# EAGLE design ESP_LED_CUBE (EAGLE 8.4.0)
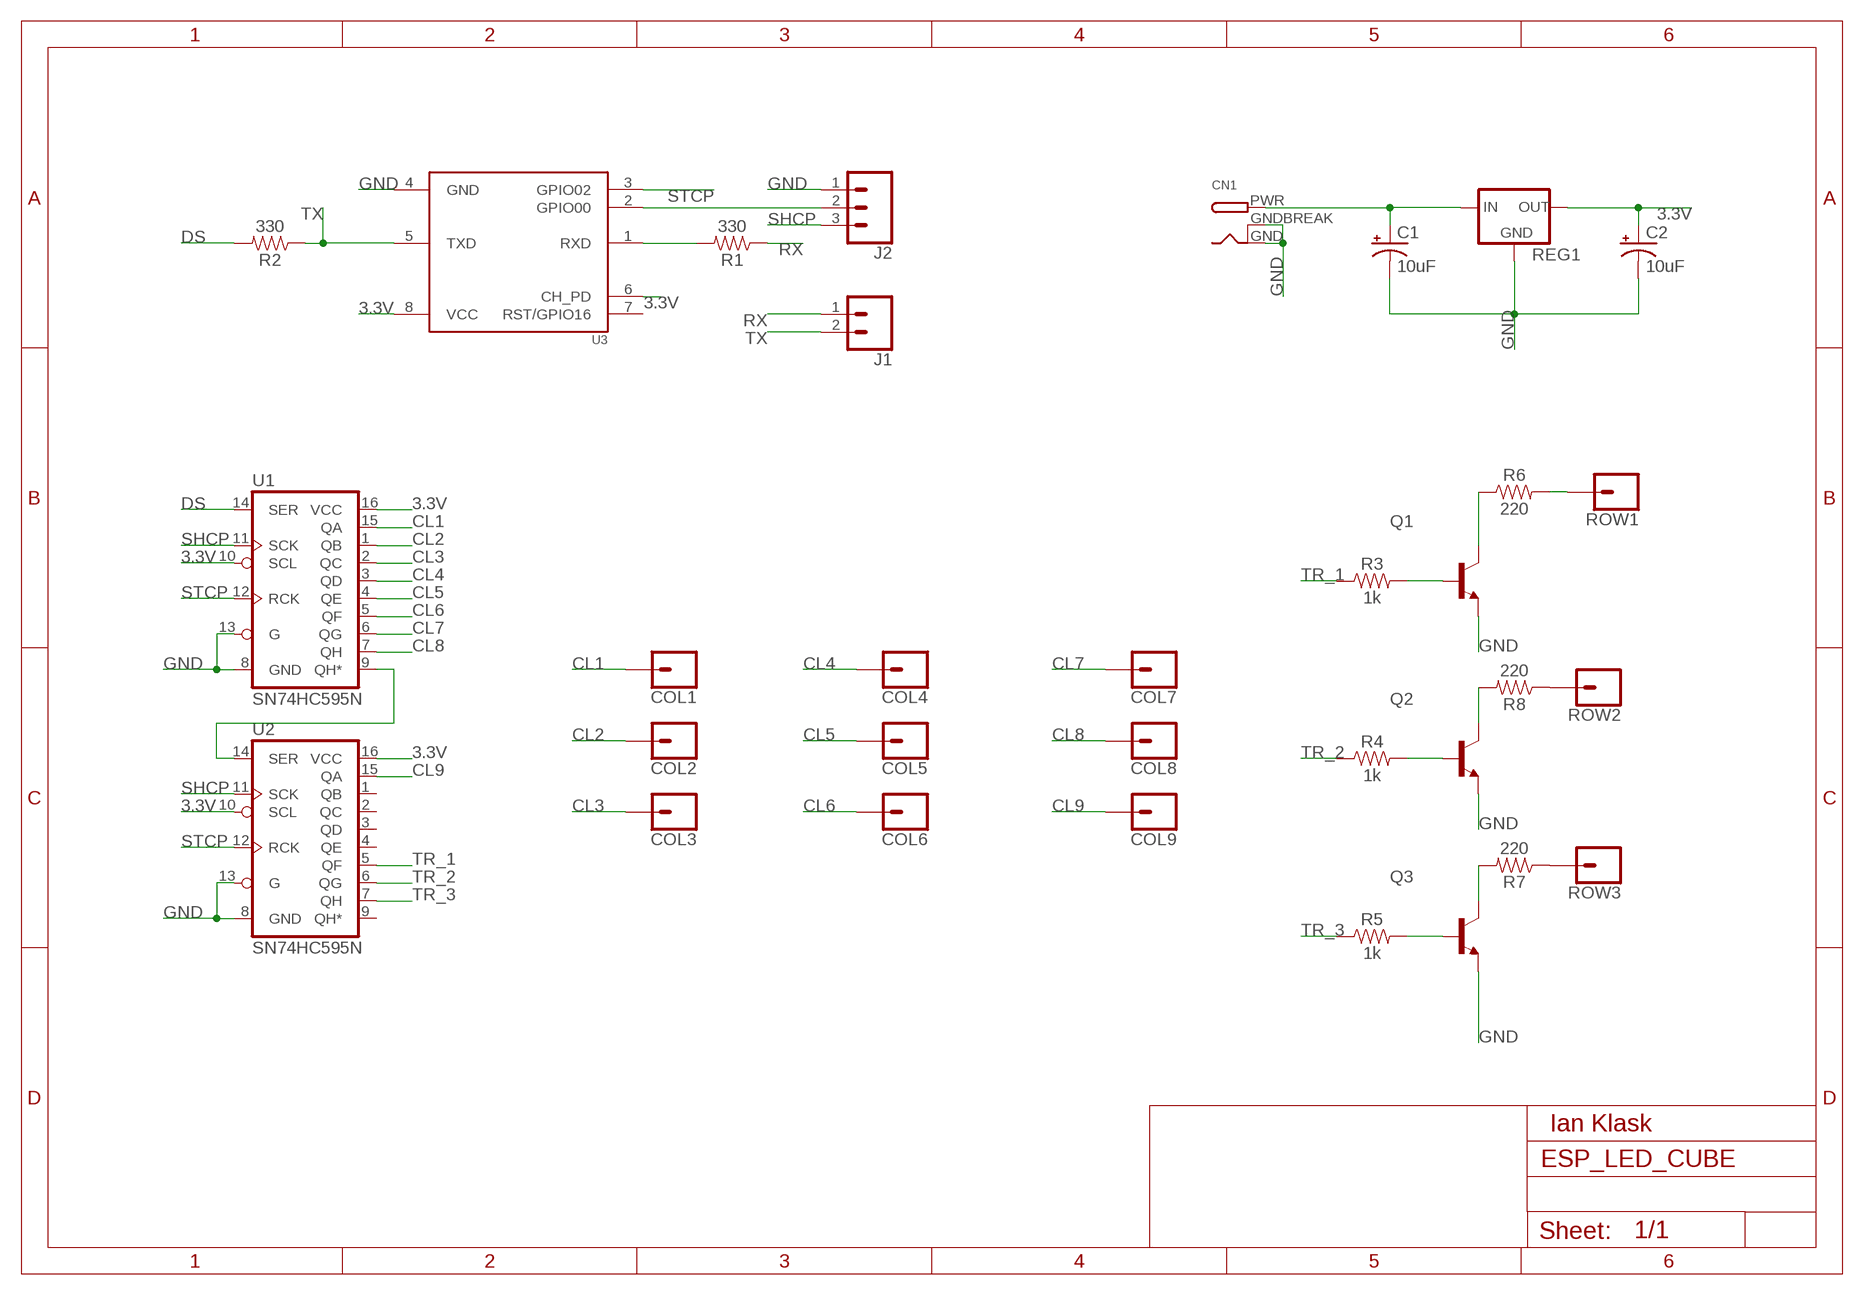
[diagram p0: schematic, sheet 1]

## Parts
C1  10uF  10UF-POLAR-RADIAL-2.5MM-25V-20%  [CPOL-RADIAL-2.5MM-5MM]
C2  10uF  10UF-POLAR-RADIAL-2.5MM-25V-20%  [CPOL-RADIAL-2.5MM-5MM]
CN1  DCBARRELPTH  [DCJACK_2MM_PTH]
COL1  CONN_01  [1X01]
COL2  CONN_01  [1X01]
COL3  CONN_01  [1X01]
COL4  CONN_01  [1X01]
COL5  CONN_01  [1X01]
COL6  CONN_01  [1X01]
COL7  CONN_01  [1X01]
COL8  CONN_01  [1X01]
COL9  CONN_01  [1X01]
J1  CONN_02  [1X02]
J2  CONN_03  [1X03]
Q1  2N3904  [TO92]
Q2  2N3904  [TO92]
Q3  2N3904  [TO92]
R1  330  330OHM-HORIZ-1/10W-5%  [AXIAL-0.3]
R2  330  330OHM-HORIZ-1/10W-5%  [AXIAL-0.3]
R3  1k  1KOHM-HORIZ-1/4W-1%  [AXIAL-0.3]
R4  1k  1KOHM-HORIZ-1/4W-1%  [AXIAL-0.3]
R5  1k  1KOHM-HORIZ-1/4W-1%  [AXIAL-0.3]
R6  220  330OHM-HORIZ-1/10W-5%  [AXIAL-0.3]
R7  220  330OHM-HORIZ-1/10W-5%  [AXIAL-0.3]
R8  220  330OHM-HORIZ-1/10W-5%  [AXIAL-0.3]
REG1  V_REG_LD1117VXX  [78XXL]
ROW1  CONN_01  [1X01]
ROW2  CONN_01  [1X01]
ROW3  CONN_01  [1X01]
U1  SN74HC595N  74HC595N  [DIP16]
U2  SN74HC595N  74HC595N  [DIP16]
U3  ESP8266-01/ESP-01  [XCVR_ESP8266-01/ESP-01]

## Nets
3.3V: C2.1(+) REG1.GND(OUT) U1.10(SCL) U1.16(VCC) U2.10(SCL) U2.16(VCC) U3.6(CH_PD) U3.8(VCC)
CL1: COL1.1 U1.15(QA)
CL2: COL2.1 U1.1(QB)
CL3: COL3.1 U1.2(QC)
CL4: COL4.1 U1.3(QD)
CL5: COL5.1 U1.4(QE)
CL6: COL6.1 U1.5(QF)
CL7: COL7.1 U1.6(QG)
CL8: COL8.1 U1.7(QH)
CL9: COL9.1 U2.15(QA)
DS: R2.P$2 U1.14(SER)
GND: C1.2(-) C2.2(-) CN1.GND CN1.GNDBREAK J2.1 Q1.3(E) Q2.3(E) Q3.3(E) REG1.IN(GND) U1.8(GND) U1.13(G) U2.8(GND) U2.13(G) U3.4(GND)
N$1: C1.1(+) CN1.PWR REG1.OUT(IN)
N$2: U1.9(QH*) U2.14(SER)
N$3: R1.P$2 U3.1(RXD)
N$4: Q1.1(C) R6.P$1
N$5: R7.P$1 ROW3.1
N$6: R8.P$1 ROW2.1
N$7: R6.P$2 ROW1.1
N$8: Q3.1(C) R7.P$2
N$9: Q2.1(C) R8.P$2
N$10: Q3.2(B) R5.P$2
N$11: Q2.2(B) R4.P$2
N$12: Q1.2(B) R3.P$2
N$16: J2.2 U3.2(GPIO00)
RX: J1.1 R1.P$1
SHCP: J2.3 U1.11(SCK) U2.11(SCK)
STCP: U1.12(RCK) U2.12(RCK) U3.3(GPIO02)
TR_1: R3.P$1 U2.5(QF)
TR_2: R4.P$1 U2.6(QG)
TR_3: R5.P$1 U2.7(QH)
TX: J1.2 R2.P$1 U3.5(TXD)
Unconnected: U2.1(QB) U2.2(QC) U2.3(QD) U2.4(QE) U2.9(QH*) U3.7(RST/GPIO16)

## Notes on the sheet
- Ian Klask

## Library data of the parts
C1 C2 = SparkFun-Capacitors:10UF-POLAR: 10.0µF polarized capacitors A capacitor is a passive two-terminal electrical component used to store electrical energy temporarily in an electric field.; PROD_ID: CAP-08440
CN1 = adafruit:DCBARREL: 2.0mm DC Barrel Jack DCJACK_2MM_PTH - Through Hole Jack (4UConnector: 05537)
COL1-COL9 ROW1-ROW3 = SparkFun-Connectors:CONN_01: Single connection point. Often used as Generic Header-pin footprint for 0.1 inch spaced/style header connections On any of the 0.1 inch spaced packages, you can populate with these: Break Away Headers - Straight <https://www.sparkfun.com/products/116> (PRT-00116) Break Away Male Headers - Right Angle <https://www.sparkfun.com/products/553> (PRT-00553) Female Headers <https://www.sparkfun.com/products/115> (PRT-00115) Break Away Headers - Machine Pin <https://www.sparkfun.com/products/117> (PRT-00117) Break Away Female Headers - Swiss Machine Pin <https://www.sparkfun.com/products/743> (PRT-00743) This device is also useful as a general connection point to wire up your design to another part of your project. Our various solder wires solder well into these plated through hole pads. Hook-Up Wire - Assortment (Stranded, 22 AWG) <https://www.sparkfun.com/products/11375> (PRT-11375) Hook-Up Wire - Assortment (Solid Core, 22 AWG) <https://www.sparkfun.com/products/11367> (PRT-11367) View the entire wire category on our website here <https://www.sparkfun.com/categories/141> Special notes: SMTSO-256-ET is a "flush mount" nut for a 4-40 screw. We mostly use this on specialty testbeds; it is a nice way to connect hardware to your PCB at an adjustable hieght. Also note, the SNAP packages are for using a snappable style connector. We sell a baggie of snaps and they are also used on two LilyPad designs: Snap Assortment - 30 pack (male and female) <https://www.sparkfun.com/products/11347> (DEV-11347) LilyPad Arduino SimpleSnap <https://www.sparkfun.com/products/10941> (DEV-10941) LilyPad SimpleSnap Protoboard <https://www.sparkfun.com/products/10940> (DEV-10940)
J1 = SparkFun-Connectors:CONN_02: Multi connection point. Often used as Generic Header-pin footprint for 0.1 inch spaced/style header connections On any of the 0.1 inch spaced packages, you can populate with these: Break Away Headers - Straight <https://www.sparkfun.com/products/116> (PRT-00116) Break Away Male Headers - Right Angle <https://www.sparkfun.com/products/553> (PRT-00553) Female Headers <https://www.sparkfun.com/products/115> (PRT-00115) Break Away Headers - Machine Pin <https://www.sparkfun.com/products/117> (PRT-00117) Break Away Female Headers - Swiss Machine Pin <https://www.sparkfun.com/products/743> (PRT-00743) For SCREWTERMINALS and SPRING TERMINALS visit here: Screw Terimnals on SparkFun.com <https://www.sparkfun.com/search/results?term=Screw+Terminals> (5mm/3.5mm/2.54mm spacing) This device is also useful as a general connection point to wire up your design to another part of your project. Our various solder wires solder well into these plated through hole pads. Hook-Up Wire - Assortment (Stranded, 22 AWG) <https://www.sparkfun.com/products/11375> (PRT-11375) Hook-Up Wire - Assortment (Solid Core, 22 AWG) <https://www.sparkfun.com/products/11367> (PRT-11367) View the entire wire category on our website here <https://www.sparkfun.com/categories/141> Special notes: Molex polarized connector foot print use with: PRT-08233 with associated crimp pins and housings. 2.54_SCREWTERM for use with PRT-10571. 3.5mm Screw Terminal footprints for PRT-08084 5mm Screw Terminal footprints for use with PRT-08432
J2 = SparkFun-Connectors:CONN_03: Multi connection point. Often used as Generic Header-pin footprint for 0.1 inch spaced/style header connections On any of the 0.1 inch spaced packages, you can populate with these: Break Away Headers - Straight <https://www.sparkfun.com/products/116> (PRT-00116) Break Away Male Headers - Right Angle <https://www.sparkfun.com/products/553> (PRT-00553) Female Headers <https://www.sparkfun.com/products/115> (PRT-00115) Break Away Headers - Machine Pin <https://www.sparkfun.com/products/117> (PRT-00117) Break Away Female Headers - Swiss Machine Pin <https://www.sparkfun.com/products/743> (PRT-00743) Stackable Header - 3 Pin (Female, 0.1") <https://www.sparkfun.com/products/13875> (PRT-13875) For SCREWTERMINALS and SPRING TERMINALS visit here: Screw Terimnals on SparkFun.com <https://www.sparkfun.com/search/results?term=Screw+Terminals> (5mm/3.5mm/2.54mm spacing) This device is also useful as a general connection point to wire up your design to another part of your project. Our various solder wires solder well into these plated through hole pads. Hook-Up Wire - Assortment (Stranded, 22 AWG) <https://www.sparkfun.com/products/11375> (PRT-11375) Hook-Up Wire - Assortment (Solid Core, 22 AWG) <https://www.sparkfun.com/products/11367> (PRT-11367) View the entire wire category on our website here <https://www.sparkfun.com/categories/141> Special notes: Molex polarized connector foot print use with SKU : PRT-08232 with associated crimp pins and housings.
Q1-Q3 = transistor-npn:2N3904: NPN Transistor
R1 R2 = SparkFun-Resistors:330OHM: 330Ω resistor A resistor is a passive two-terminal electrical component that implements electrical resistance as a circuit element. Resistors act to reduce current flow, and, at the same time, act to lower voltage levels within circuits. - Wikipedia; PROD_ID: RES-8371
R3-R5 = SparkFun-Resistors:1KOHM: 1kΩ resistor A resistor is a passive two-terminal electrical component that implements electrical resistance as a circuit element. Resistors act to reduce current flow, and, at the same time, act to lower voltage levels within circuits. - Wikipedia; PROD_ID: RES-12182
R6-R8 = SparkFun-Resistors:330OHM: 330Ω resistor A resistor is a passive two-terminal electrical component that implements electrical resistance as a circuit element. Resistors act to reduce current flow, and, at the same time, act to lower voltage levels within circuits. - Wikipedia; PROD_ID: RES-8371; VALUE: 330
REG1 = SparkFun-IC-Power:V_REG_LD1117VXX: LD1117VXX voltage regulator. We carry the 3.3V version (COM-00526) in TO-220 package.
U1 U2 = SparkFun-IC-Logic:74*595: 8-Bit Shift Register (Serial to Parallel) Datasheet <http://cdn.sparkfun.com/datasheets/BreakoutBoards/MM74HC595.pdf> SparkFun Products SparkFun Shift Register Breakout - 74HC595 <https://www.sparkfun.com/products/10680> (BOB-10680); PROD_ID: IC-13123
U3 = ESP8266-01_ESP-01:ESP8266-01/ESP-01: ESP-01 wifi module; AVAILABILITY: Unavailable; MP: ESP8266-01/ESP-01; PACKAGE: None; PRICE: None

## Board
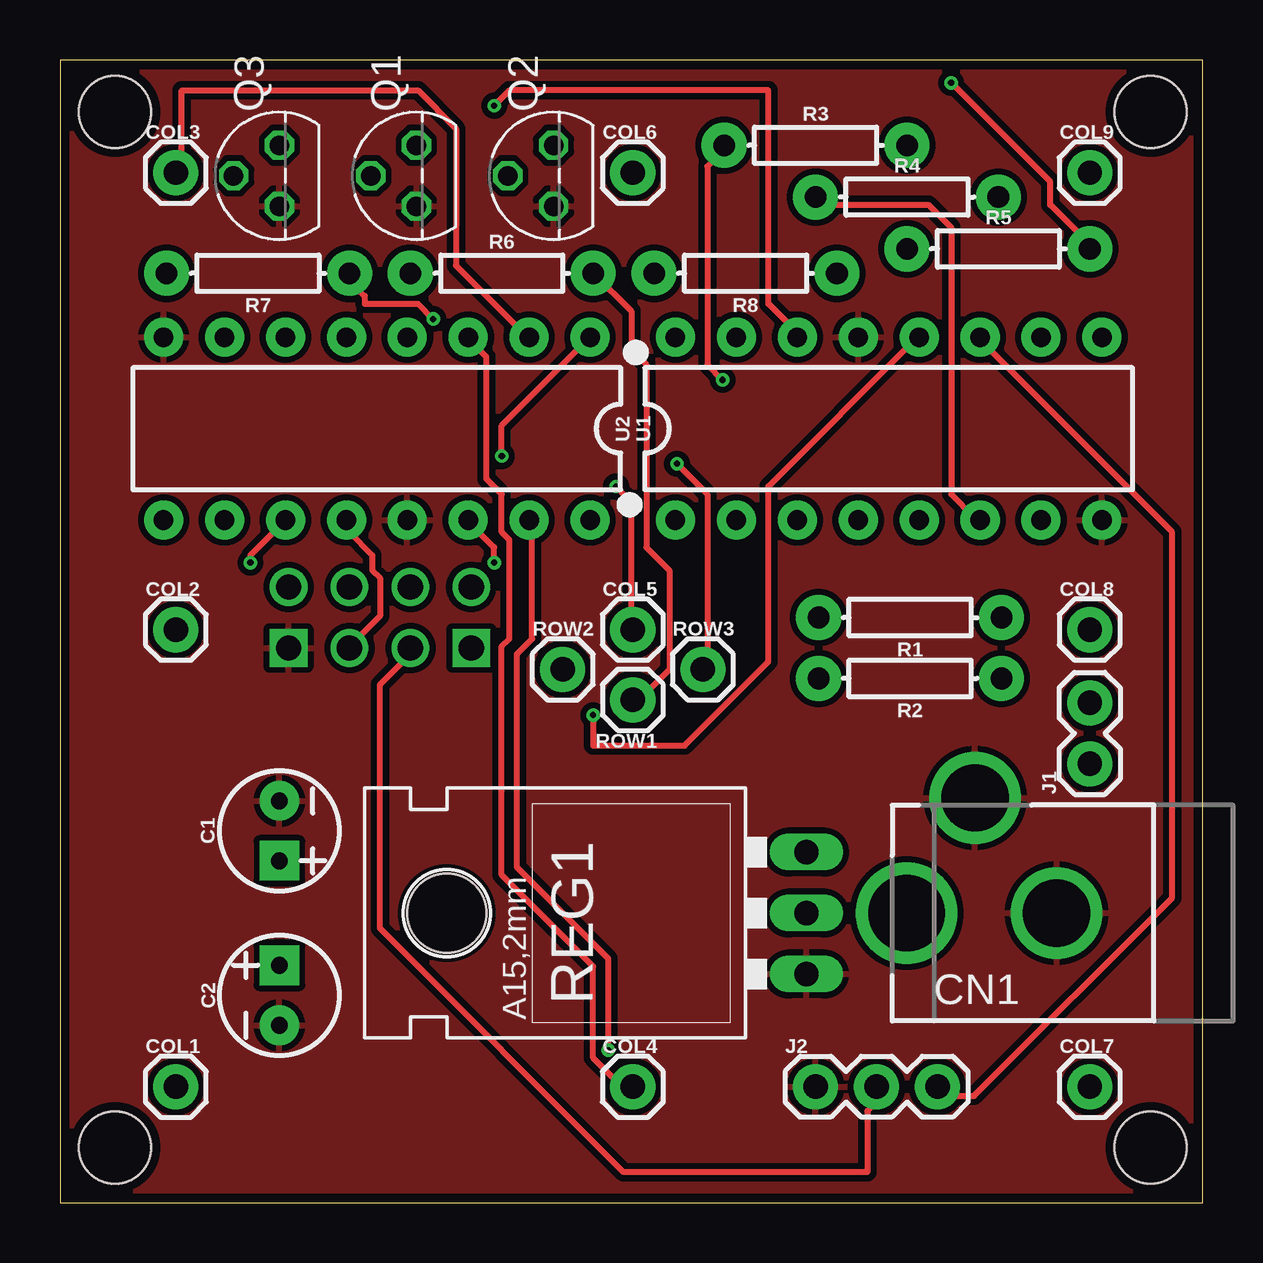
[diagram p1: board, top side]
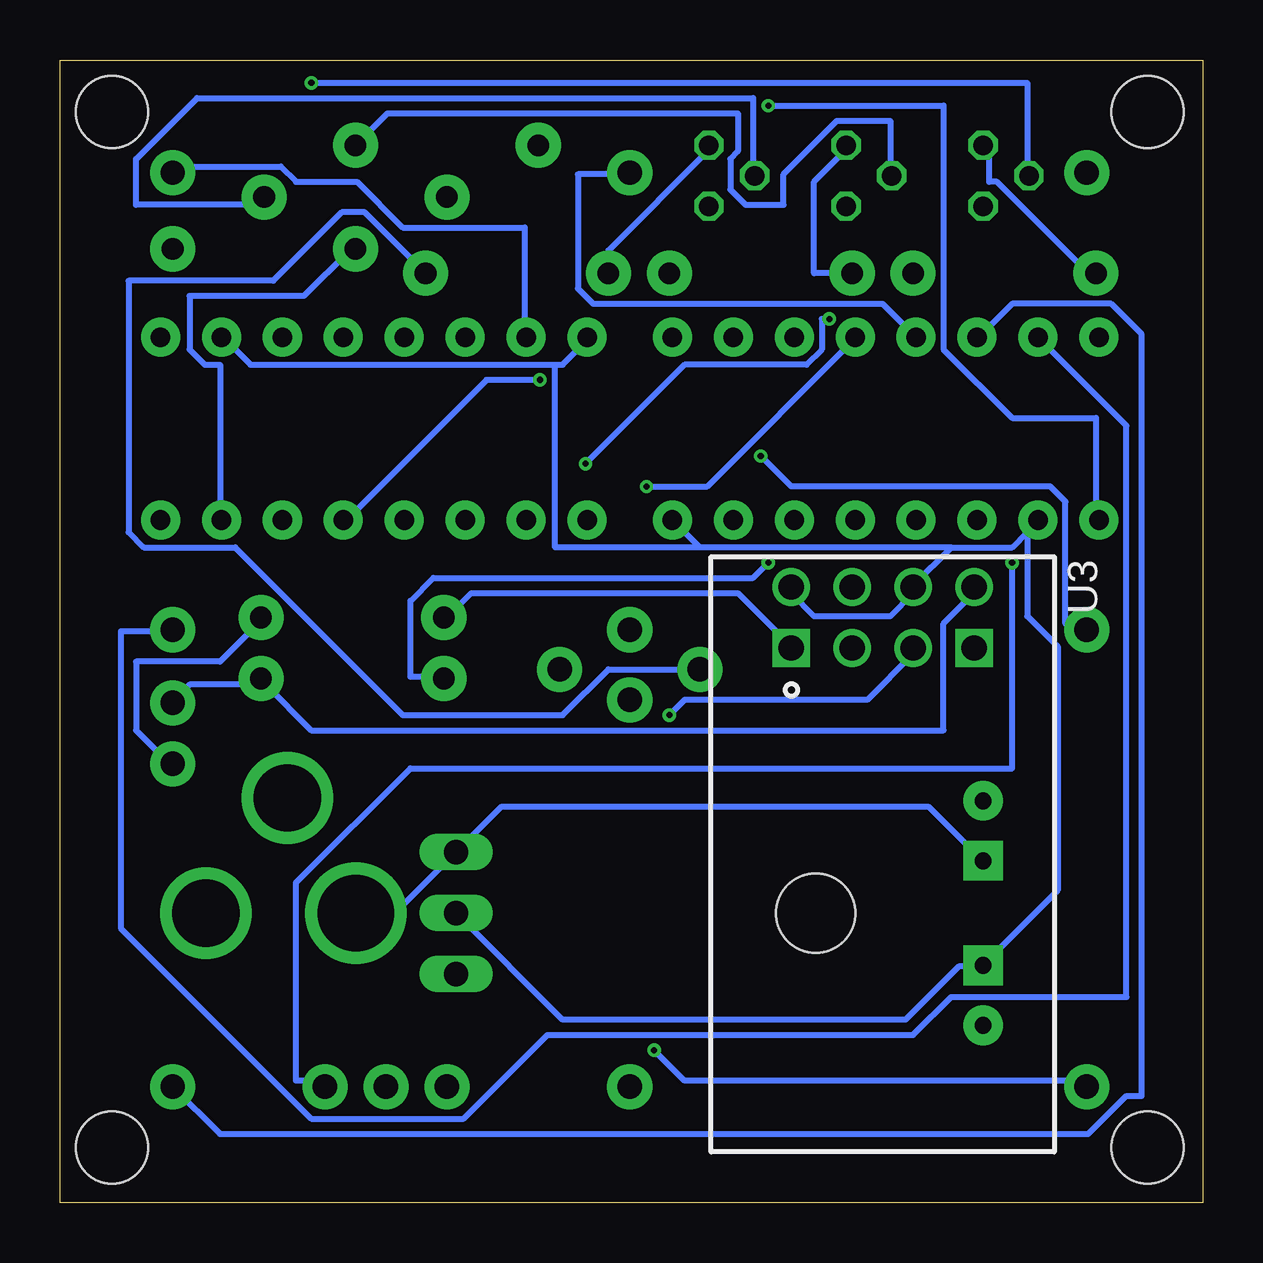
[diagram p2: board, bottom side, seen from below]

Size 47.62 x 47.62 mm. Coordinates in mm from the lower left corner, seen from the top.
Outline: 0,0 47.62,0 47.62,47.62 0,47.62 0,0
Copper layers (1*16): Top 0.035559375mm / dielectric 1.6mm / Bottom 0.035559375mm
Design rules "oshpark-2layer-auto-routing": minimum track width 10mil, minimum drill 10mil, track to track 10mil, track to pad 8mil, pad to pad 8mil, via to via 8mil, smd to smd 6mil, copper to edge 15mil, drill to drill 6mil, minimum pad ring 6mil, minimum via ring 6mil, stop-mask expansion 2.5mil, vias tented up to drill 0mil, thermal gap 10mil
Holes 3 mm at 2.29,45.47 45.47,45.47 45.47,2.29 2.29,2.29

### Footprints (pad centres in the part's own frame; a part is rotated, then mirrored left to right if it is on the bottom)
CPOL-RADIAL-2.5MM-5MM = drill 0.7 pad 1.651 square: 1 1.25,0 | drill 0.7 pad 1.651: 2 -1.25,0
DCJACK_2MM_PTH = drill 2.8: GND 0,7.35; GNDBREAK 4.8,10.75 | drill 3.2: PWR 0,13.6
1X01 = drill 1.016 pad 1.88: 1 0,0
1X02 = drill 1.016 pad 1.88: 1 0,0; 2 2.54,0
1X03 = drill 1.016 pad 1.88: 1 0,0; 2 2.54,0; 3 5.08,0
TO92 = drill 0.813 octagon: 1 1.27,0; 2 0,1.905; 3 -1.27,0
AXIAL-0.3 = drill 0.9 pad 1.88: P$1 -3.81,0; P$2 3.81,0
78XXL = drill 1.016 long: GND 0,-3.81; IN -2.54,-3.81; OUT 2.54,-3.81 | hole 3.302: 0,11.176
DIP16 = drill 0.813 pad 1.626: 1 -8.89,-3.81; 2 -6.35,-3.81; 3 -3.81,-3.81; 4 -1.27,-3.81; 5 1.27,-3.81; 6 3.81,-3.81; 7 6.35,-3.81; 8 8.89,-3.81; 9 8.89,3.81; 10 6.35,3.81; 11 3.81,3.81; 12 1.27,3.81; 13 -1.27,3.81; 14 -3.81,3.81; 15 -6.35,3.81; 16 -8.89,3.81
XCVR_ESP8266-01/ESP-01 = drill 1.05 square: 1 0,-3.81; 4 0,3.81 | drill 1.05: 2 0,-1.27; 3 0,1.27; 5 -2.54,3.81; 6 -2.54,1.27; 7 -2.54,-1.27; 8 -2.54,-3.81

### Placement (x,y rotation side)
C1  9.14,15.49 270 top
C2  9.14,8.64 90 top
CN1  48.9,12.06 90 top
COL1  4.83,4.83 0 top
COL2  4.83,23.88 0 top
COL3  4.83,42.93 0 top
COL4  23.88,4.83 0 top
COL5  23.88,23.88 0 top
COL6  23.88,42.93 0 top
COL7  42.93,4.83 0 top
COL8  42.93,23.88 0 top
COL9  42.93,42.93 0 top
J1  42.93,18.29 90 top
J2  31.5,4.83 0 top
Q1  14.86,42.8 90 top
Q2  20.57,42.8 90 top
Q3  9.14,42.8 90 top
R1  35.43,24.38 180 top
R2  35.43,21.84 180 top
R3  31.5,44.07 0 top
R4  35.31,41.91 0 top
R5  39.12,39.75 0 top
R6  18.41,38.73 0 top
R7  8.26,38.73 180 top
R8  28.57,38.73 180 top
REG1  27.3,12.06 90 top
ROW1  23.88,20.95 0 top
ROW2  20.95,22.23 0 top
ROW3  26.8,22.23 0 top
U1  13.21,32.26 180 top
U2  34.54,32.26 0 top
U3  13.34,23.11 270 bottom

### Tracks (layer width: path | path; a pad name or v marks a point on that pad's centre or on a via)
3.3V
  Bottom 0.254: REG1.GND 26.67,7.62 12.38,7.62 10.16,9.84 9.21,9.84 C2.1 8.89,10.16 6.03,13.02 6.03,23.18 7.3,24.45 7.3,27.94 | 26.99,34.92 39.69,34.92 40.64,35.88 U2.10 | 26.99,34.92 26.67,34.92 25.72,35.88 U2.16 | U3.8 17.14,25.4 16.19,24.45 13.02,24.45 12.06,25.4 U3.6 12.06,25.72 10.48,27.3 | 7.3,27.94 7.94,27.3 10.48,27.3 | 7.3,27.94 6.99,28.26 U1.10 7.3,27.94 | 20.95,27.3 U1.16 | 10.48,27.3 20.95,27.3 | 26.99,34.92 26.99,27.3 20.95,27.3
CL1  (via drill 0.25)
  Top 0.254: v22.86,6.35 22.86,10.16 19.05,13.97 19.05,22.86 19.68,23.5 19.68,28.26 U1.15
  Bottom 0.254: v22.86,6.35 21.59,5.08 5.08,5.08 COL1.1
CL2  (via drill 0.25)
  Top 0.254: U1.1 18.41,32.38 v18.41,31.11
  Bottom 0.254: v18.41,31.11 17.14,29.84 6.35,29.84 5.71,29.21 5.71,24.13 5.08,24.13 COL2.1
CL3
  Top 0.254: U1.2 19.37,36.2 16.51,39.05 16.51,44.77 14.92,46.35 5.08,46.35 5.08,43.18 COL3.1
CL4
  Top 0.254: U1.3 17.14,35.88 17.78,35.24 17.78,30.16 18.41,29.53 18.41,27.94 18.73,27.62 18.73,23.5 18.41,23.18 18.41,13.65 22.23,9.84 22.23,6.03 23.18,5.08 23.81,5.08 COL4.1
CL5  (via drill 0.25)
  Top 0.254: v23.18,29.84 23.81,29.21 23.81,24.13 COL5.1
  Bottom 0.254: v23.18,29.84 20.64,29.84 14.61,35.88 U1.4
CL6
  Bottom 0.254: U1.5 13.34,37.47 25.4,37.47 26.04,38.1 26.04,42.86 24.13,42.86 COL6.1
CL7
  Bottom 0.254: COL7.1 40.96,2.86 4.76,2.86 3.17,4.45 2.54,4.45 2.54,36.2 3.81,37.47 7.94,37.47 9.21,36.2 U1.6
CL8
  Bottom 0.254: U1.7 3.17,32.38 3.17,8.57 10.48,8.57 12.06,6.99 27.3,6.99 30.8,3.49 37.15,3.49 45.09,11.43 45.09,23.81 43.18,23.81 COL8.1
CL9
  Bottom 0.254: U2.15 28.26,36.2 28.26,40.64 33.34,40.64 35.24,42.55 37.78,42.55 38.42,43.18 42.86,43.18 COL9.1
DS  (via drill 0.25)
  Top 0.254: v18.1,26.67 18.1,27.3 17.14,28.26 U1.14
  Bottom 0.254: v18.1,26.67 18.73,26.04 32.07,26.04 33.02,25.08 33.02,21.91 31.75,21.91 R2.P$2
GND
  pour Top: 0,47.62 0,0 47.62,0 47.62,47.62
N$1
  Bottom 0.254: CN1.PWR 33.66,12.06 REG1.OUT 29.21,16.51 11.43,16.51 9.21,14.29 C1.1
N$2  (via drill 0.25)
  Top 0.254: v18.1,45.72 18.73,46.35 29.53,46.35 29.53,37.47 30.48,36.51 30.48,36.2 U2.14
  Bottom 0.254: v18.1,45.72 10.79,45.72 10.79,35.56 7.94,32.7 4.45,32.7 4.45,28.57 U1.9
N$3
  Bottom 0.254: U3.1 17.14,23.18 19.37,25.4 30.48,25.4 31.43,24.45 R1.P$2
N$4
  Bottom 0.254: R6.P$1 16.19,38.73 16.19,42.55 14.92,43.81 Q1.1
N$5  (via drill 0.25)
  Top 0.254: v25.72,30.8 26.99,29.53 26.99,22.23 ROW3.1 | v15.56,36.83 14.92,37.47 12.7,37.47 12.7,37.78 12.06,38.42 R7.P$1
  Bottom 0.254: v25.72,30.8 21.59,34.92 16.51,34.92 15.88,35.56 15.88,36.83 v15.56,36.83
N$6
  Bottom 0.254: ROW2.1 24.77,22.23 26.67,20.32 33.34,20.32 40.32,27.3 44.13,27.3 44.77,27.94 44.77,38.42 38.73,38.42 35.88,41.27 34.92,41.27 R8.P$1
N$7
  Top 0.254: R6.P$2 23.81,37.15 23.81,35.56 24.45,34.92 24.45,27.3 25.4,26.35 25.4,22.23 24.13,20.95 ROW1.1
N$8
  Bottom 0.254: R7.P$2 4.76,38.73 8.57,42.55 8.89,42.55 8.89,43.81 Q3.1
N$9
  Bottom 0.254: R8.P$2 24.77,39.69 20.64,43.81 Q2.1
N$10  (via drill 0.25)
  Top 0.254: v37.15,46.67 41.27,42.55 41.27,41.59 42.86,40.01 R5.P$2
  Bottom 0.254: v37.15,46.67 7.3,46.67 7.3,42.86 Q3.2
N$11
  Bottom 0.254: Q2.2 18.73,42.86 18.73,46.04 41.91,46.04 44.45,43.5 44.45,41.59 39.69,41.59 39.37,41.91 R4.P$2
N$12
  Bottom 0.254: R3.P$2 33.97,45.4 19.37,45.4 19.37,43.81 19.68,43.5 19.68,42.23 19.05,41.59 17.46,41.59 17.46,42.86 15.24,45.09 13.02,45.09 13.02,42.86 Q1.2
N$16
  Top 0.254: U3.2 14.61,22.86 13.34,21.59 13.34,11.43 23.5,1.27 33.66,1.27 33.66,3.81 33.97,4.13 33.97,4.76 J2.2
RX
  Bottom 0.254: J1.1 43.18,18.41 44.45,19.68 44.45,22.54 40.96,22.54 39.37,24.13 R1.P$1
SHCP  (via drill 0.25)
  Top 0.254: U1.11 7.94,26.99 v7.94,26.67 | U2.11 38.42,35.88 46.35,27.94 46.35,12.7 38.1,4.45 36.83,4.45 36.83,4.76 J2.3
  Bottom 0.254: v7.94,26.67 7.94,18.1 33.02,18.1 37.78,13.34 37.78,5.08 36.83,5.08 J2.3
STCP  (via drill 0.25)
  Top 0.254: U3.3 12.06,23.18 13.34,24.45 13.34,26.04 13.02,26.35 13.02,26.99 12.06,27.94 12.06,28.26 U1.12 | v22.23,20.32 22.23,19.05 26.04,19.05 29.53,22.54 29.53,29.84 35.56,35.88 U2.12
  Bottom 0.254: v22.23,20.32 21.59,20.95 13.97,20.95 12.06,22.86 U3.3
TR_1  (via drill 0.25)
  Top 0.254: v27.62,34.29 26.99,34.92 26.99,43.18 27.62,43.81 R3.P$1
  Bottom 0.254: v27.62,34.29 29.84,34.29 35.56,28.57 U2.5
TR_2
  Top 0.254: U2.6 38.1,28.57 37.15,29.53 37.15,40.64 36.2,41.59 31.75,41.59 31.75,41.91 R4.P$1
TR_3
  Bottom 0.254: U2.7 40.96,28.57 40.96,34.92 41.59,34.92 42.23,35.56 42.23,37.78 37.47,37.78 35.56,39.69 R5.P$1
TX
  Bottom 0.254: U3.5 9.53,25.4 10.79,24.13 10.79,19.68 37.15,19.68 39.05,21.59 R2.P$1 39.37,21.59 42.23,21.59 42.86,20.95 J1.2